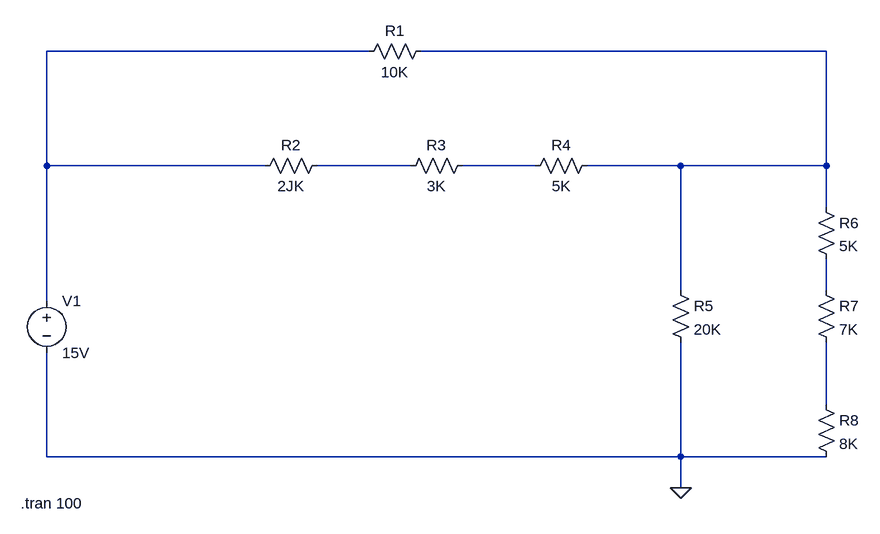
[diagram p0: schematic Draft1.asc]
Draft1.asc, the LTspice schematic file:
Version 4
SHEET 1 1384 680
WIRE 624 -464 128 -464
WIRE 1328 -464 704 -464
WIRE 128 -288 128 -464
WIRE 464 -288 128 -288
WIRE 688 -288 544 -288
WIRE 880 -288 768 -288
WIRE 1104 -288 960 -288
WIRE 1328 -288 1328 -464
WIRE 1328 -288 1104 -288
WIRE 1328 -224 1328 -288
WIRE 1104 -96 1104 -288
WIRE 1328 -96 1328 -144
WIRE 128 -80 128 -288
WIRE 1328 80 1328 -16
WIRE 128 160 128 0
WIRE 1104 160 1104 -16
WIRE 1104 160 128 160
WIRE 1328 160 1104 160
WIRE 1104 208 1104 160
FLAG 1104 208 0
SYMBOL res 720 -480 R90
WINDOW 0 0 56 VBottom 2
WINDOW 3 32 56 VTop 2
SYMATTR InstName R1
SYMATTR Value 10K
SYMBOL res 560 -304 R90
WINDOW 0 0 56 VBottom 2
WINDOW 3 32 56 VTop 2
SYMATTR InstName R2
SYMATTR Value 2JK
SYMBOL res 784 -304 R90
WINDOW 0 0 56 VBottom 2
WINDOW 3 32 56 VTop 2
SYMATTR InstName R3
SYMATTR Value 3K
SYMBOL res 976 -304 R90
WINDOW 0 0 56 VBottom 2
WINDOW 3 32 56 VTop 2
SYMATTR InstName R4
SYMATTR Value 5K
SYMBOL res 1088 -112 R0
SYMATTR InstName R5
SYMATTR Value 20K
SYMBOL res 1312 -240 R0
SYMATTR InstName R6
SYMATTR Value 5K
SYMBOL res 1312 -112 R0
SYMATTR InstName R7
SYMATTR Value 7K
SYMBOL res 1312 64 R0
SYMATTR InstName R8
SYMATTR Value 8K
SYMBOL voltage 128 -96 R0
WINDOW 123 0 0 Left 0
WINDOW 39 0 0 Left 0
SYMATTR InstName V1
SYMATTR Value 15V
TEXT 88 232 Left 2 !.tran 100

The netlist it stands for:
* Draft1.asc
R1 N002 N001 10K
R2 N003 N001 2JK
R3 N004 N003 3K
R4 N002 N004 5K
R5 N002 0 20K
R6 N002 N005 5K
R7 N005 N006 7K
R8 N006 0 8K
V1 N001 0 15V
.tran 100
.backanno
.end